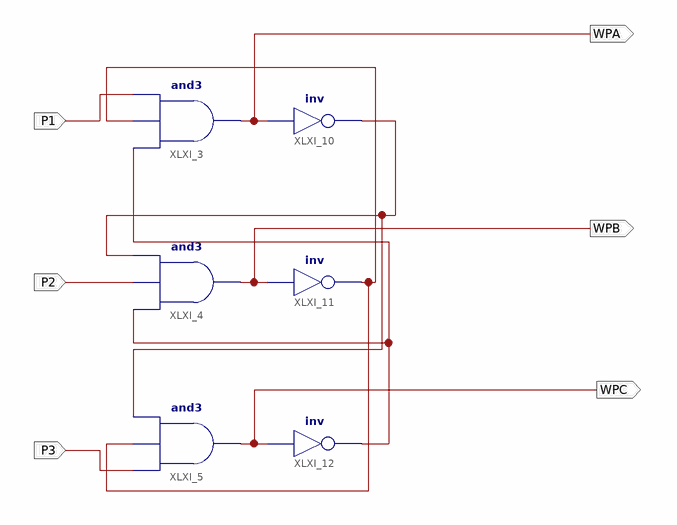
[diagram p0: schematic sheet 1]
// Xilinx ISE schematic answerV2.sch (spartan6) as structural Verilog: 6 symbols, 6 ports
module answerV2 (
  input  P1,
  input  P2,
  input  P3,
  output WPA,
  output WPB,
  output WPC
);

  wire XLXN_7, XLXN_10, XLXN_13;

  and XLXI_3 (WPA, XLXN_7, XLXN_13, P1);
  and XLXI_4 (WPB, XLXN_7, P2, XLXN_10);
  and XLXI_5 (WPC, P3, XLXN_13, XLXN_10);
  not XLXI_10 (XLXN_10, WPA);
  not XLXI_11 (XLXN_13, WPB);
  not XLXI_12 (XLXN_7, WPC);
endmodule
